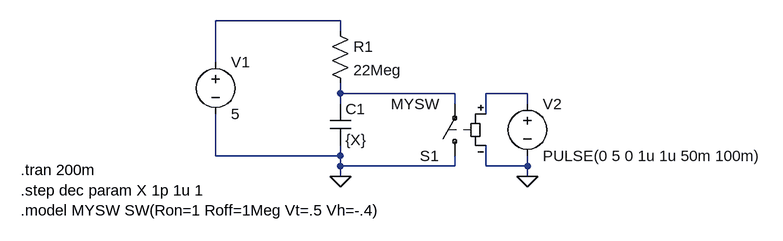
[diagram p0: schematic CapSense.asc]
CapSense.asc, the LTspice schematic file:
Version 4
SHEET 1 1184 680
WIRE 208 -16 16 -16
WIRE 208 0 208 -16
WIRE 16 48 16 -16
WIRE 208 96 208 80
WIRE 384 96 208 96
WIRE 496 96 432 96
WIRE 208 112 208 96
WIRE 384 112 384 96
WIRE 496 112 496 96
WIRE 432 128 432 96
WIRE 16 192 16 128
WIRE 208 192 208 176
WIRE 208 192 16 192
WIRE 208 208 208 192
WIRE 384 208 384 192
WIRE 384 208 208 208
WIRE 432 208 432 176
WIRE 496 208 496 192
WIRE 496 208 432 208
WIRE 208 224 208 208
WIRE 496 224 496 208
FLAG 496 224 0
FLAG 208 224 0
SYMBOL voltage 16 32 R0
WINDOW 123 0 0 Left 0
WINDOW 39 0 0 Left 0
SYMATTR InstName V1
SYMATTR Value 5
SYMBOL res 192 -16 R0
SYMATTR InstName R1
SYMATTR Value 22Meg
SYMBOL cap 192 112 R0
SYMATTR InstName C1
SYMATTR Value {X}
SYMATTR SpiceLine IC=0
SYMBOL sw 384 208 R180
SYMATTR InstName S1
SYMATTR Value MYSW
SYMBOL voltage 496 96 R0
WINDOW 123 0 0 Left 0
WINDOW 39 0 0 Left 0
SYMATTR InstName V2
SYMATTR Value PULSE(0 5 0 1u 1u 50m 100m)
TEXT -284 214 Left 2 !.tran 200m\n.step dec param X 1p 1u 1\n.model MYSW SW(Ron=1 Roff=1Meg Vt=.5 Vh=-.4)

The netlist it stands for:
* CapSense.asc
V1 N001 0 5
R1 N001 N002 22Meg
C1 N002 0 {X} IC=0
S1 0 N002 N003 0 MYSW
V2 N003 0 PULSE(0 5 0 1u 1u 50m 100m)
.tran 200m
.step dec param X 1p 1u 1
.model MYSW SW(Ron=1 Roff=1Meg Vt=.5 Vh=-.4)
.backanno
.end